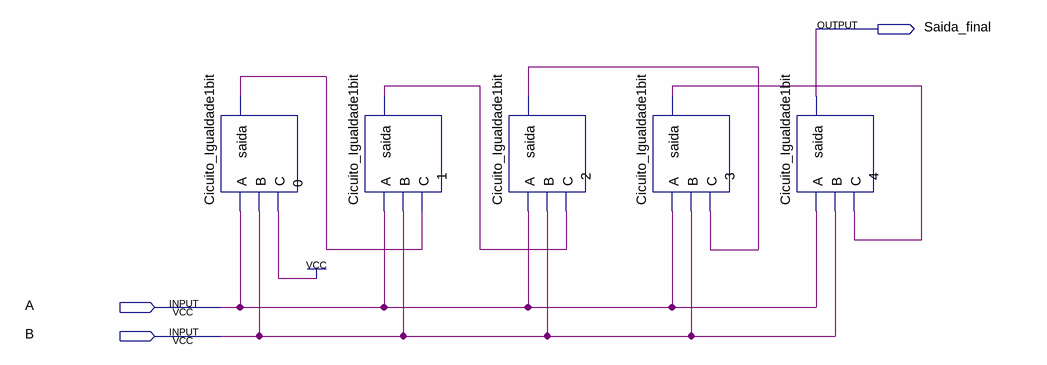
[diagram p0: schematic sheet]
// Quartus schematic Circuito_Igualdade_4bits.bdf as structural Verilog: 5 symbols, 3 pins
module Circuito_Igualdade_4bits (
  input  A,
  input  B,
  output Saida_final
);

  wire n0_saida, n1_saida, n2_saida, n3_saida;

  Cicuito_Igualdade1bit u_0 (.A(A), .B(B), .C(1'b1), .saida(n0_saida));
  Cicuito_Igualdade1bit u_1 (.A(A), .B(B), .C(n0_saida), .saida(n1_saida));
  Cicuito_Igualdade1bit u_2 (.A(A), .B(B), .C(n1_saida), .saida(n2_saida));
  Cicuito_Igualdade1bit u_3 (.A(A), .B(B), .C(n2_saida), .saida(n3_saida));
  Cicuito_Igualdade1bit u_4 (.A(A), .B(B), .C(n3_saida), .saida(Saida_final));
endmodule
